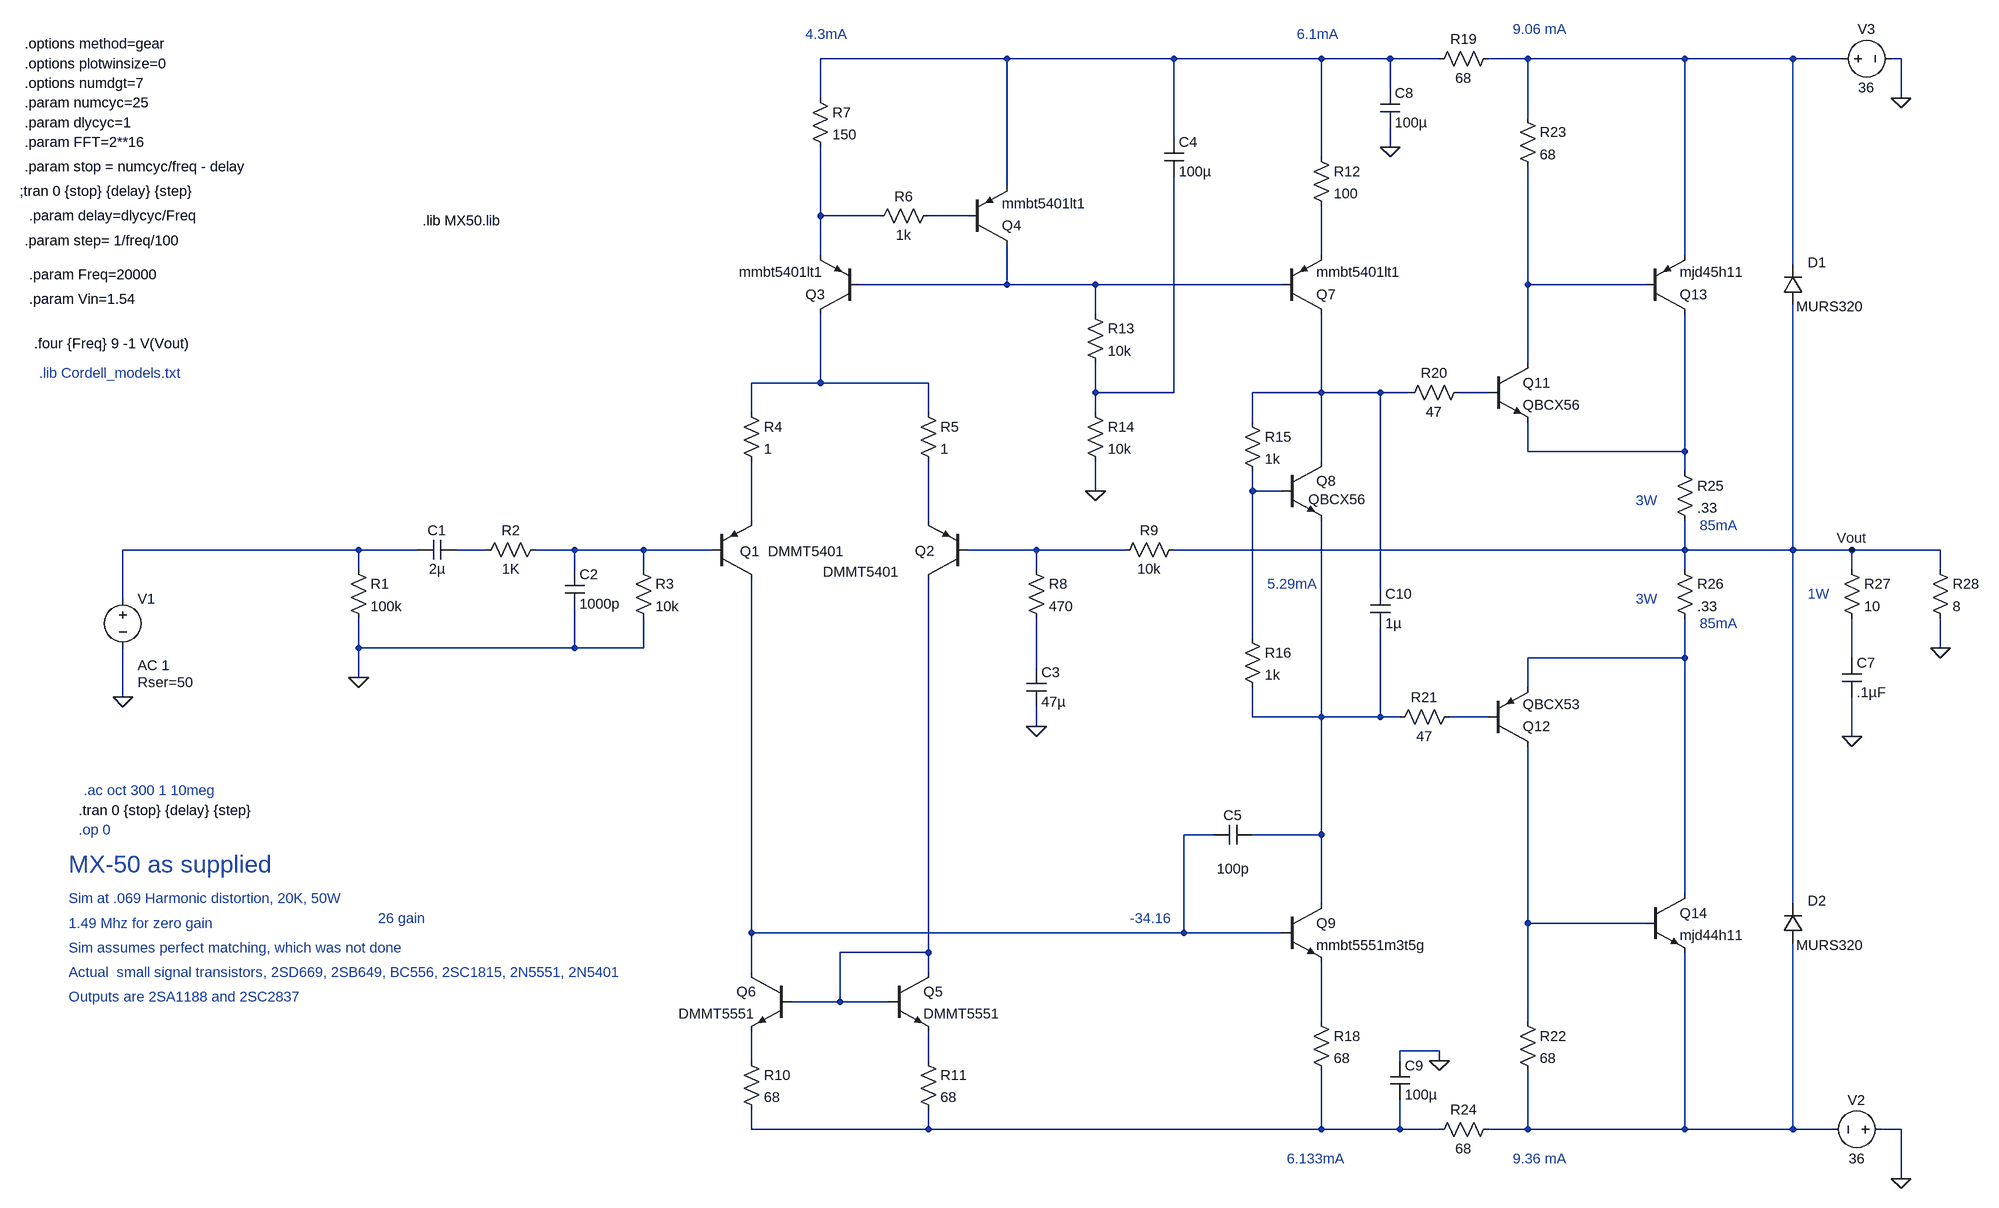
[diagram p0: schematic MX-50.asc]
MX-50.asc, the LTspice schematic file:
Version 4
SHEET 1 1692 1012
WIRE -144 -832 -448 -832
WIRE 128 -832 -144 -832
WIRE 368 -832 128 -832
WIRE 480 -832 368 -832
WIRE 560 -832 480 -832
WIRE 704 -832 640 -832
WIRE 960 -832 704 -832
WIRE 1136 -832 960 -832
WIRE 1216 -832 1136 -832
WIRE 1312 -832 1296 -832
WIRE 480 -784 480 -832
WIRE -448 -768 -448 -832
WIRE 1312 -768 1312 -832
WIRE 704 -736 704 -832
WIRE 128 -704 128 -832
WIRE 480 -688 480 -720
WIRE 368 -672 368 -832
WIRE -144 -624 -144 -832
WIRE -448 -576 -448 -688
WIRE -352 -576 -448 -576
WIRE -208 -576 -272 -576
WIRE -448 -512 -448 -576
WIRE 368 -512 368 -592
WIRE 960 -512 960 -832
WIRE 1136 -496 1136 -832
WIRE -144 -464 -144 -528
WIRE -144 -464 -384 -464
WIRE 0 -464 -144 -464
WIRE 304 -464 0 -464
WIRE 704 -464 704 -656
WIRE 896 -464 704 -464
WIRE 0 -416 0 -464
WIRE 704 -336 704 -464
WIRE -448 -304 -448 -416
WIRE -448 -304 -560 -304
WIRE -272 -304 -448 -304
WIRE 0 -288 0 -336
WIRE 128 -288 128 -640
WIRE 128 -288 0 -288
WIRE 368 -288 368 -416
WIRE 368 -288 256 -288
WIRE 464 -288 368 -288
WIRE 512 -288 464 -288
WIRE 640 -288 592 -288
WIRE -560 -256 -560 -304
WIRE -272 -256 -272 -304
WIRE 0 -256 0 -288
WIRE 256 -240 256 -288
WIRE 704 -192 704 -240
WIRE 960 -192 960 -416
WIRE 960 -192 704 -192
WIRE 368 -176 368 -288
WIRE 960 -160 960 -192
WIRE 0 -128 0 -176
WIRE 256 -128 256 -160
WIRE 304 -128 256 -128
WIRE -560 -80 -560 -176
WIRE -272 -80 -272 -176
WIRE -1200 -32 -1584 -32
WIRE -1104 -32 -1200 -32
WIRE -992 -32 -1040 -32
WIRE -848 -32 -912 -32
WIRE -736 -32 -848 -32
WIRE -624 -32 -736 -32
WIRE -96 -32 -208 -32
WIRE 48 -32 -96 -32
WIRE 960 -32 960 -80
WIRE 960 -32 128 -32
WIRE 1136 -32 1136 -432
WIRE 1136 -32 960 -32
WIRE 1232 -32 1136 -32
WIRE 1376 -32 1232 -32
WIRE -1200 0 -1200 -32
WIRE -848 0 -848 -32
WIRE -736 0 -736 -32
WIRE -96 0 -96 -32
WIRE 960 0 960 -32
WIRE 1232 0 1232 -32
WIRE 1376 0 1376 -32
WIRE 464 32 464 -288
WIRE -1584 48 -1584 -32
WIRE 256 112 256 -128
WIRE -1200 128 -1200 80
WIRE -848 128 -848 64
WIRE -848 128 -1200 128
WIRE -736 128 -736 80
WIRE -736 128 -848 128
WIRE 1376 128 1376 80
WIRE 960 144 960 80
WIRE 960 144 704 144
WIRE 1232 144 1232 80
WIRE -96 160 -96 80
WIRE -1200 176 -1200 128
WIRE 704 192 704 144
WIRE -1584 208 -1584 128
WIRE 256 240 256 192
WIRE 368 240 368 -80
WIRE 368 240 256 240
WIRE 464 240 464 96
WIRE 464 240 368 240
WIRE 496 240 464 240
WIRE 640 240 576 240
WIRE -96 256 -96 224
WIRE 1232 272 1232 208
WIRE 192 432 144 432
WIRE 368 432 368 240
WIRE 368 432 256 432
WIRE 960 528 960 144
WIRE 368 544 368 432
WIRE 1136 544 1136 -32
WIRE 704 576 704 288
WIRE 896 576 704 576
WIRE -560 592 -560 16
WIRE 144 592 144 432
WIRE 144 592 -560 592
WIRE 304 592 144 592
WIRE -272 624 -272 16
WIRE -272 624 -416 624
WIRE -560 656 -560 592
WIRE -272 656 -272 624
WIRE -416 704 -416 624
WIRE -416 704 -496 704
WIRE -336 704 -416 704
WIRE 368 736 368 640
WIRE 704 736 704 576
WIRE 560 784 496 784
WIRE -560 800 -560 752
WIRE -272 800 -272 752
WIRE 496 800 496 784
WIRE 560 800 560 784
WIRE -560 912 -560 880
WIRE -272 912 -272 880
WIRE -272 912 -560 912
WIRE 368 912 368 816
WIRE 368 912 -272 912
WIRE 496 912 496 864
WIRE 496 912 368 912
WIRE 560 912 496 912
WIRE 704 912 704 816
WIRE 704 912 640 912
WIRE 960 912 960 624
WIRE 960 912 704 912
WIRE 1136 912 1136 608
WIRE 1136 912 960 912
WIRE 1200 912 1136 912
WIRE 1312 912 1280 912
WIRE 1312 992 1312 912
FLAG -1584 208 0
FLAG -1200 176 0
FLAG -96 256 0
FLAG 0 -128 0
FLAG 1232 272 0
FLAG 1376 128 0
FLAG 1312 992 0
FLAG 1232 -32 Vout
FLAG 1312 -768 0
FLAG 480 -688 0
FLAG 560 800 0
SYMBOL voltage -1584 32 R0
WINDOW 123 24 124 Left 2
WINDOW 39 24 152 Left 2
WINDOW 3 24 96 Invisible 2
SYMATTR Value2 AC 1
SYMATTR SpiceLine Rser=50
SYMATTR Value SINE(0 {Vin} {Freq} 0 0 0 {numcyc})
SYMATTR InstName V1
SYMBOL res -1216 -16 R0
SYMATTR InstName R1
SYMATTR Value 100k
SYMATTR SpiceLine tol=1
SYMBOL cap -1040 -48 R90
WINDOW 0 0 32 VBottom 2
WINDOW 3 32 32 VTop 2
SYMATTR InstName C1
SYMATTR Value 2µ
SYMBOL res -896 -48 R90
WINDOW 0 0 56 VBottom 2
WINDOW 3 32 56 VTop 2
SYMATTR InstName R2
SYMATTR Value 1K
SYMBOL cap -864 0 R0
SYMATTR InstName C2
SYMATTR Value 1000p
SYMBOL res -752 -16 R0
SYMATTR InstName R3
SYMATTR Value 10k
SYMATTR SpiceLine tol=1
SYMBOL pnp -624 16 M180
WINDOW 0 45 45 Left 2
WINDOW 3 91 45 Left 2
SYMATTR InstName Q1
SYMATTR Value DMMT5401
SYMBOL pnp -208 16 R180
WINDOW 0 54 46 Left 2
WINDOW 3 109 12 Left 2
SYMATTR InstName Q2
SYMATTR Value DMMT5401
SYMBOL res -576 -272 R0
SYMATTR InstName R4
SYMATTR Value 1
SYMATTR SpiceLine tol=1
SYMBOL res -288 -272 R0
SYMATTR InstName R5
SYMATTR Value 1
SYMATTR SpiceLine tol=1
SYMBOL pnp -384 -416 R180
SYMATTR InstName Q3
SYMATTR Value mmbt5401lt1
SYMBOL pnp -208 -528 M180
SYMATTR InstName Q4
SYMATTR Value mmbt5401lt1
SYMBOL res -256 -592 R90
WINDOW 0 0 56 VBottom 2
WINDOW 3 32 56 VTop 2
SYMATTR InstName R6
SYMATTR Value 1k
SYMATTR SpiceLine tol=1
SYMBOL res -464 -784 R0
SYMATTR InstName R7
SYMATTR Value 150
SYMBOL res -112 -16 R0
SYMATTR InstName R8
SYMATTR Value 470
SYMATTR SpiceLine tol=1
SYMBOL cap -112 160 R0
SYMATTR InstName C3
SYMATTR Value 47µ
SYMBOL res 144 -48 R90
WINDOW 0 0 56 VBottom 2
WINDOW 3 32 56 VTop 2
SYMATTR InstName R9
SYMATTR Value 10k
SYMBOL npn -336 656 R0
SYMATTR InstName Q5
SYMATTR Value DMMT5551
SYMBOL npn -496 656 M0
SYMATTR InstName Q6
SYMATTR Value DMMT5551
SYMBOL res -576 784 R0
SYMATTR InstName R10
SYMATTR Value 68
SYMATTR SpiceLine tol=1
SYMBOL res -288 784 R0
SYMATTR InstName R11
SYMATTR Value 68
SYMATTR SpiceLine tol=1
SYMBOL pnp 304 -416 M180
SYMATTR InstName Q7
SYMATTR Value mmbt5401lt1
SYMBOL res 352 -688 R0
SYMATTR InstName R12
SYMATTR Value 100
SYMATTR SpiceLine tol=1
SYMBOL res -16 -432 R0
SYMATTR InstName R13
SYMATTR Value 10k
SYMBOL res -16 -272 R0
SYMATTR InstName R14
SYMATTR Value 10k
SYMBOL cap 112 -704 R0
SYMATTR InstName C4
SYMATTR Value 100µ
SYMBOL npn 304 -176 R0
WINDOW 3 43 62 Left 2
SYMATTR Value QBCX56
SYMATTR InstName Q8
SYMBOL res 240 -256 R0
SYMATTR InstName R15
SYMATTR Value 1k
SYMATTR SpiceLine tol=1
SYMBOL res 240 96 R0
SYMATTR InstName R16
SYMATTR Value 1k
SYMATTR SpiceLine tol=1
SYMBOL npn 304 544 R0
SYMATTR InstName Q9
SYMATTR Value mmbt5551m3t5g
SYMBOL res 352 720 R0
SYMATTR InstName R18
SYMATTR Value 68
SYMATTR SpiceLine tol=1
SYMBOL cap 256 416 R90
WINDOW 0 0 32 VBottom 2
WINDOW 3 56 31 VTop 2
SYMATTR InstName C5
SYMATTR Value 100p
SYMBOL npn 640 -336 R0
SYMATTR InstName Q11
SYMATTR Value QBCX56
SYMBOL res 656 -848 R90
WINDOW 0 0 56 VBottom 2
WINDOW 3 32 56 VTop 2
SYMATTR InstName R19
SYMATTR Value 68
SYMBOL res 608 -304 R90
WINDOW 0 0 56 VBottom 2
WINDOW 3 32 56 VTop 2
SYMATTR InstName R20
SYMATTR Value 47
SYMBOL res 592 224 R90
WINDOW 0 0 56 VBottom 2
WINDOW 3 32 56 VTop 2
SYMATTR InstName R21
SYMATTR Value 47
SYMBOL res 688 720 R0
SYMATTR InstName R22
SYMATTR Value 68
SYMBOL res 688 -752 R0
SYMATTR InstName R23
SYMATTR Value 68
SYMBOL res 656 896 R90
WINDOW 0 0 56 VBottom 2
WINDOW 3 32 56 VTop 2
SYMATTR InstName R24
SYMATTR Value 68
SYMBOL pnp 896 -416 M180
SYMATTR InstName Q13
SYMATTR Value mjd45h11
SYMBOL npn 896 528 R0
SYMATTR InstName Q14
SYMATTR Value mjd44h11
SYMBOL res 944 -176 R0
SYMATTR InstName R25
SYMATTR Value .33
SYMBOL res 944 -16 R0
SYMATTR InstName R26
SYMATTR Value .33
SYMBOL res 1216 -16 R0
SYMATTR InstName R27
SYMATTR Value 10
SYMBOL res 1360 -16 R0
SYMATTR InstName R28
SYMATTR Value 8
SYMBOL cap 1216 144 R0
SYMATTR InstName C7
SYMATTR Value .1µF
SYMBOL diode 1152 -432 R180
WINDOW 0 -39 68 Left 2
WINDOW 3 -100 -4 Left 2
SYMATTR InstName D1
SYMATTR Value MURS320
SYMBOL pnp 640 288 M180
SYMATTR InstName Q12
SYMATTR Value QBCX53
SYMBOL voltage 1296 912 R90
WINDOW 0 -32 56 VBottom 2
WINDOW 3 32 56 VTop 2
WINDOW 123 0 0 Left 2
WINDOW 39 0 0 Left 2
SYMATTR InstName V2
SYMATTR Value 36
SYMBOL voltage 1200 -832 R270
WINDOW 0 32 56 VTop 2
WINDOW 3 -32 56 VBottom 2
WINDOW 123 0 0 Left 2
WINDOW 39 0 0 Left 2
SYMATTR InstName V3
SYMATTR Value 36
SYMBOL cap 464 -784 R0
SYMATTR InstName C8
SYMATTR Value 100µ
SYMBOL cap 480 800 R0
SYMATTR InstName C9
SYMATTR Value 100µ
SYMBOL cap 448 32 R0
SYMATTR InstName C10
SYMATTR Value 1µ
SYMBOL diode 1152 608 R180
WINDOW 0 -39 68 Left 2
WINDOW 3 -100 -4 Left 2
SYMATTR InstName D2
SYMATTR Value MURS320
TEXT -1744 -824 Left 2 !.options plotwinsize=0
TEXT -1744 -792 Left 2 !.options numdgt=7
TEXT -1744 -728 Left 2 !.param dlycyc=1
TEXT -1744 -760 Left 2 !.param numcyc=25
TEXT -1744 -696 Left 2 !.param FFT=2**16
TEXT -1744 -856 Left 2 !.options method=gear
TEXT -1752 -616 Left 2 !;tran 0 {stop} {delay} {step}
TEXT -1648 360 Left 2 ;.ac oct 300 1 10meg
TEXT -1744 -656 Left 2 !.param stop = numcyc/freq - delay
TEXT -1736 -576 Left 2 !.param delay=dlycyc/Freq
TEXT -1736 -480 Left 2 !.param Freq=20000
TEXT -1744 -536 Left 2 !.param step= 1/freq/100
TEXT -1728 -368 Left 2 !.four {Freq} 9 -1 V(Vout)
TEXT -1736 -440 Left 2 !.param Vin=1.54
TEXT -1672 480 Left 4 ;MX-50 as supplied
TEXT -1672 536 Left 2 ;Sim at .069 Harmonic distortion, 20K, 50W
TEXT -1672 616 Left 2 ;Sim assumes perfect matching, which was not done
TEXT -1672 656 Left 2 ;Actual  small signal transistors, 2SD669, 2SB649, BC556, 2SC1815, 2N5551, 2N5401
TEXT -1672 696 Left 2 ;Outputs are 2SA1188 and 2SC2837
TEXT 984 88 Left 2 ;85mA
TEXT 984 -72 Left 2 ;85mA
TEXT 328 -872 Left 2 ;6.1mA
TEXT -472 -872 Left 2 ;4.3mA
TEXT -1168 568 Left 2 ;26 gain
TEXT 680 -880 Left 2 ;9.06 mA
TEXT 56 568 Left 2 ;-34.16
TEXT 312 960 Left 2 ;6.133mA
TEXT 680 960 Left 2 ;9.36 mA
TEXT 280 24 Left 2 ;5.29mA
TEXT -1672 576 Left 2 ;1.49 Mhz for zero gain
TEXT -1720 -320 Left 2 ;.lib Cordell_models.txt
TEXT -1096 -568 Left 2 !.lib MX50.lib
TEXT 880 -112 Left 2 ;3W
TEXT 880 48 Left 2 ;3W
TEXT -1656 392 Left 2 !.tran 0 {stop} {delay} {step}
TEXT -1656 424 Left 2 ;.op 0
TEXT 1160 40 Left 2 ;1W

The netlist it stands for:
* MX-50.asc
V1 N016 0 SINE(0 {Vin} {Freq} 0 0 0 {numcyc}) AC 1 Rser=50
R1 N016 0 100k tol=1
C1 N017 N016 2µ
R2 N018 N017 1K
C2 N018 0 1000p
R3 N018 0 10k tol=1
Q1 N025 N018 N014 0 DMMT5401
Q2 N027 N019 N015 0 DMMT5401
R4 N008 N014 1 tol=1
R5 N008 N015 1 tol=1
Q3 N008 N006 N003 0 mmbt5401lt1
Q4 N006 N004 N001 0 mmbt5401lt1
R6 N004 N003 1k tol=1
R7 N001 N003 150
R8 N019 N022 470 tol=1
C3 N022 0 47µ
R9 Vout N019 10k
Q5 N027 N027 N030 0 DMMT5551
Q6 N025 N027 N029 0 DMMT5551
R10 N029 N031 68 tol=1
R11 N030 N031 68 tol=1
Q7 N010 N006 N005 0 mmbt5401lt1
R12 N001 N005 100 tol=1
R13 N006 N009 10k
R14 N009 0 10k
C4 N001 N009 100µ
Q8 N010 N013 N023 0 QBCX56
R15 N010 N013 1k tol=1
R16 N013 N023 1k tol=1
Q9 N023 N025 N028 0 mmbt5551m3t5g
R18 N028 N031 68 tol=1
C5 N023 N025 100p
Q11 N007 N011 N012 0 QBCX56
R19 N002 N001 68
R20 N011 N010 47
R21 N024 N023 47
R22 N026 N032 68
R23 N002 N007 68
R24 N032 N031 68
Q13 N012 N007 N002 0 mjd45h11
Q14 N020 N026 N032 0 mjd44h11
R25 N012 Vout .33
R26 Vout N020 .33
R27 Vout N021 10
R28 Vout 0 8
C7 N021 0 .1µF
D1 Vout N002 MURS320
Q12 N026 N024 N020 0 QBCX53
V2 0 N032 36
V3 N002 0 36
C8 N001 0 100µ
C9 0 N031 100µ
C10 N010 N023 1µ
D2 N032 Vout MURS320
.model D D
.lib standard.dio
.model NPN NPN
.model PNP PNP
.lib standard.bjt
.options plotwinsize=0
.options numdgt=7
.param dlycyc=1
.param numcyc=25
.param FFT=2**16
.options method=gear
;tran 0 {stop} {delay} {step}
* .ac oct 300 1 10meg
.param stop = numcyc/freq - delay
.param delay=dlycyc/Freq
.param Freq=20000
.param step= 1/freq/100
.four {Freq} 9 -1 V(Vout)
.param Vin=1.54
* MX-50 as supplied
* Sim at .069 Harmonic distortion, 20K, 50W
* Sim assumes perfect matching, which was not done
* Actual  small signal transistors, 2SD669, 2SB649, BC556, 2SC1815, 2N5551, 2N5401
* Outputs are 2SA1188 and 2SC2837
* 85mA
* 85mA
* 6.1mA
* 4.3mA
* 26 gain
* 9.06 mA
* -34.16
* 6.133mA
* 9.36 mA
* 5.29mA
* 1.49 Mhz for zero gain
* .lib Cordell_models.txt
.lib MX50.lib
* 3W
* 3W
.tran 0 {stop} {delay} {step}
* .op 0
* 1W
.backanno
.end